# EAGLE design MBC1_1-3 (EAGLE 9.6.2)
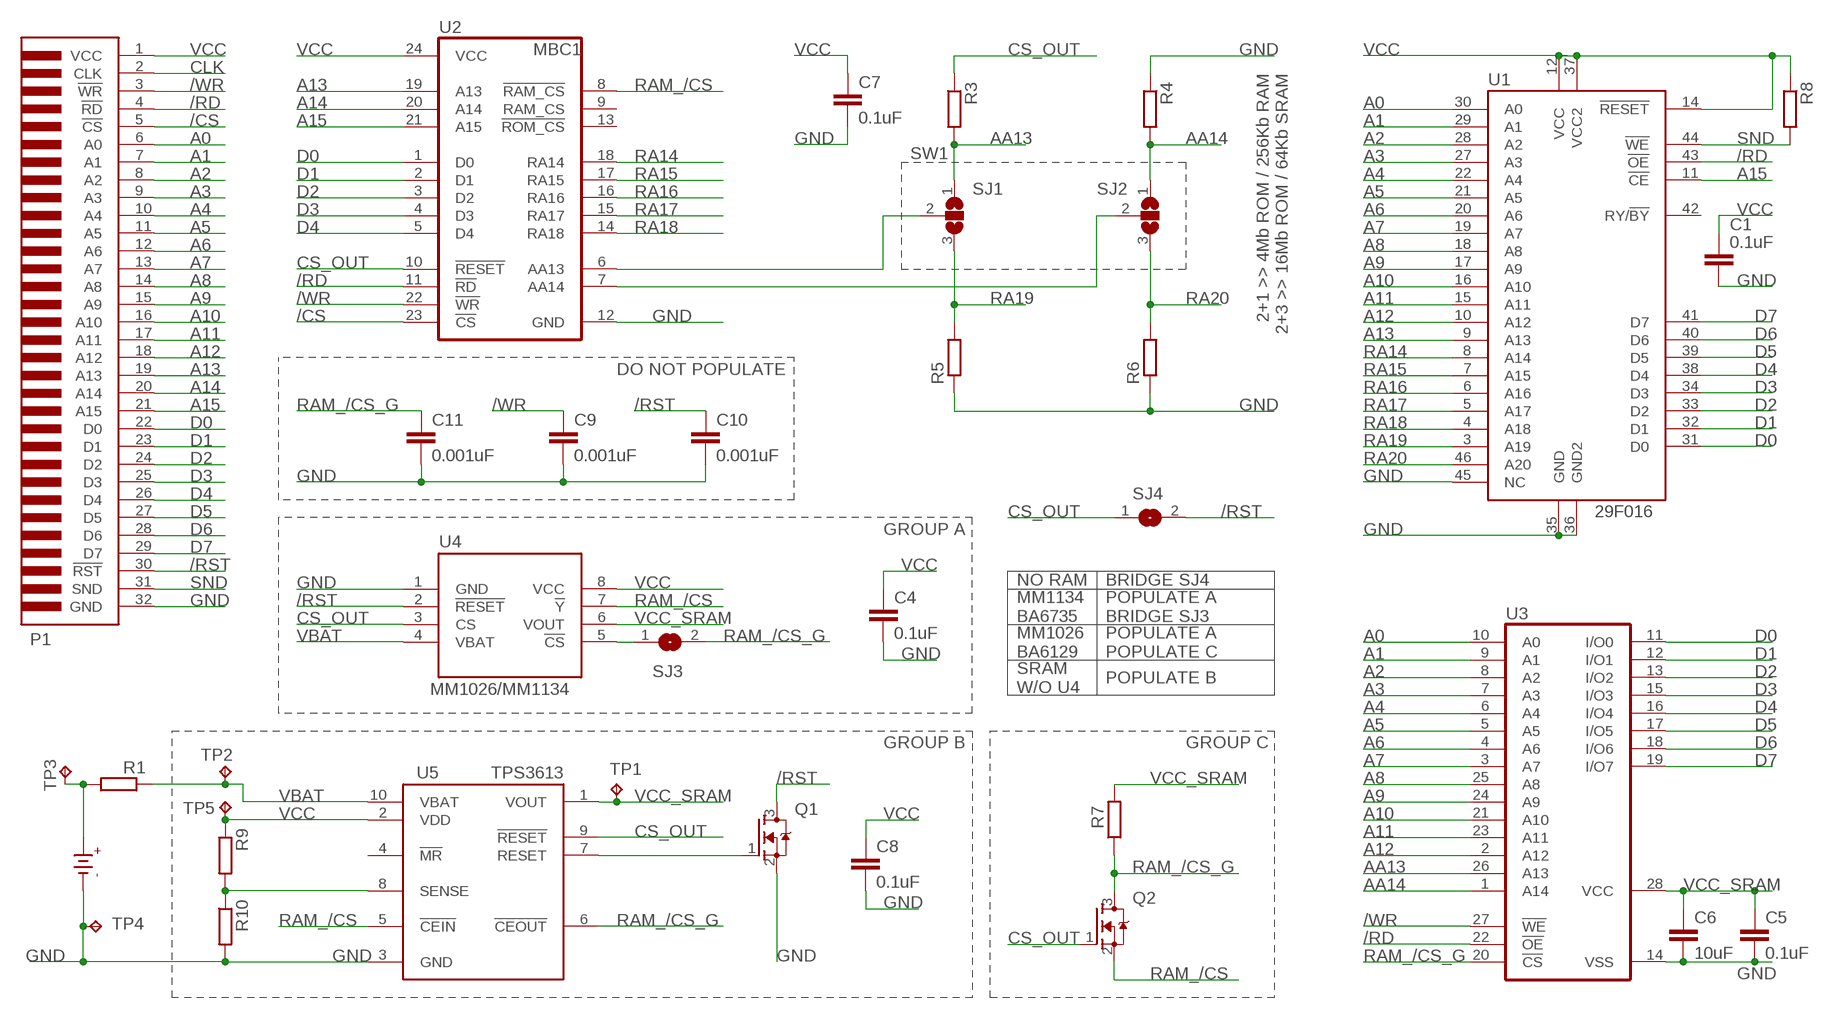
[diagram p0: schematic, sheet 1]

## Parts
B1  CR2025  [CR2025]
C1  0.1uF  C-EUC0603  [C0603]
C4  0.1uF  C-EUC0603  [C0603]
C5  0.1uF  C-EUC0603  [C0603]
C6  10uF  C-EUC0603  [C0603]
C7  0.1uF  C-EUC0603  [C0603]
C8  0.1uF  C-EUC0603  [C0603]
C9  0.001uF  C-EUC0603  [C0603]
C10  0.001uF  C-EUC0603  [C0603]
C11  0.001uF  C-EUC0603  [C0603]
P1  GBC_CART  [GBC_CART]
Q1  2N7002  MOSFET-NREFLOW  [SOT23]
Q2  2N7002  MOSFET-NREFLOW  [SOT23]
R1  RR0603  [R0603]
R3  RR0603  [R0603]
R4  RR0603  [R0603]
R5  RR0603  [R0603]
R6  RR0603  [R0603]
R7  RR0603  [R0603]
R8  RR0603  [R0603]
R9  RR0603  [R0603]
R10  RR0603  [R0603]
SJ1  SJ2W  [SJ_2]
SJ2  SJ2W  [SJ_2]
SJ3  SJ  [SJ]
SJ4  SJ  [SJ]
TP1  TPB1,27  [B1,27]
TP2  TPB1,27  [B1,27]
TP3  TPB1,27  [B1,27]
TP4  TPB1,27  [B1,27]
TP5  TPB1,27  [B1,27]
U1  29F016  [TSOP-48]
U2  MBC1  [SOP-24]
U3  62256_SRAM  [SOP-28L]
U4  MM1134  [SOIC-8]
U5  TPS3613  [MSOP-10]

## Nets
/CS: P1.5(!CS) U2.23(!CS)
/RD: P1.4(!RD) U1.43(!OE) U2.11(!RD) U3.22(!OE)
/RST: C10.1 P1.30(!RST) Q1.3(D) SJ4.2 U4.2(!RESET)
/WR: C9.1 P1.3(!WR) U2.22(!WR) U3.27(!WE)
A0: P1.6(A0) U1.30(A0) U3.10(A0)
A1: P1.7(A1) U1.29(A1) U3.9(A1)
A2: P1.8(A2) U1.28(A2) U3.8(A2)
A3: P1.9(A3) U1.27(A3) U3.7(A3)
A4: P1.10(A4) U1.22(A4) U3.6(A4)
A5: P1.11(A5) U1.21(A5) U3.5(A5)
A6: P1.12(A6) U1.20(A6) U3.4(A6)
A7: P1.13(A7) U1.19(A7) U3.3(A7)
A8: P1.14(A8) U1.18(A8) U3.25(A8)
A9: P1.15(A9) U1.17(A9) U3.24(A9)
A10: P1.16(A10) U1.16(A10) U3.21(A10)
A11: P1.17(A11) U1.15(A11) U3.23(A11)
A12: P1.18(A12) U1.10(A12) U3.2(A12)
A13: P1.19(A13) U1.9(A13) U2.19(A13)
A14: P1.20(A14) U2.20(A14)
A15: P1.21(A15) U1.11(!CE) U2.21(A15)
AA13: R3.2 SJ1.1 U3.26(A13)
AA14: R4.2 SJ2.1 U3.1(A14)
CLK: P1.2(CLK)
CS_OUT: Q2.1(G) R3.1 SJ4.1 U2.10(!RESET) U4.3(CS) U5.9(!RESET)
D0: P1.22(D0) U1.31(D0) U2.1(D0) U3.11(I/O0)
D1: P1.23(D1) U1.32(D1) U2.2(D1) U3.12(I/O1)
D2: P1.24(D2) U1.33(D2) U2.3(D2) U3.13(I/O2)
D3: P1.25(D3) U1.34(D3) U2.4(D3) U3.15(I/O3)
D4: P1.26(D4) U1.38(D4) U2.5(D4) U3.16(I/O4)
D5: P1.27(D5) U1.39(D5) U3.17(I/O5)
D6: P1.28(D6) U1.40(D6) U3.18(I/O6)
D7: P1.29(D7) U1.41(D7) U3.19(I/O7)
GND [GND]: B1.- C1.2 C4.2 C5.2 C6.2 C7.2 C8.2 C9.2 C10.2 C11.2 P1.32(GND) Q1.2(S) R4.1 R5.1 R6.1 R10.2 TP4.TP U1.35(GND) U1.36(GND2) U1.45(NC) U2.12(GND) U3.14(VSS) U4.1(GND) U5.3(GND)
N$1: SJ2.2 U2.7(AA14)
N$2: SJ1.2 U2.6(AA13)
N$3 [VCC]: B1.+ R1.2 TP3.TP
N$4: SJ3.1 U4.5(!CS)
N$6: Q1.1(G) U5.7(RESET)
N$7: R9.2 R10.1 U5.8(SENSE)
RA14: U1.8(A14) U2.18(RA14)
RA15: U1.7(A15) U2.17(RA15)
RA16: U1.6(A16) U2.16(RA16)
RA17: U1.5(A17) U2.15(RA17)
RA18: U1.4(A18) U2.14(RA18)
RA19: R5.2 SJ1.3 U1.3(A19)
RA20: R6.2 SJ2.3 U1.46(A20)
RAM_/CS: Q2.2(S) U2.8(!RAM_CS) U4.7(!Y) U5.5(!CEIN)
RAM_/CS_G: C11.1 Q2.3(D) R7.1 SJ3.2 U3.20(!CS) U5.6(!CEOUT)
SND: P1.31(SND) R8.2 U1.44(!WE)
VBAT [VCC]: R1.1 TP2.TP U4.4(VBAT) U5.10(VBAT)
VCC [VCC]: C1.1 C4.1 C7.1 C8.1 P1.1(VCC) R8.1 R9.1 TP5.TP U1.12(VCC) U1.14(!RESET) U1.37(VCC2) U2.24(VCC) U4.8(VCC) U5.2(VDD)
VCC_SRAM [VCC]: C5.1 C6.1 R7.2 TP1.TP U3.28(VCC) U4.6(VOUT) U5.1(VOUT)
Unconnected: U1.42(RY/!BY) U2.9(RAM_CS) U2.13(!ROM_CS) U5.4(!MR)

## Notes on the sheet
- 2+1 >> 4Mb ROM / 256Kb RAM
  2+3 >> 16Mb ROM / 64Kb SRAM
- SW1
- DO NOT POPULATE
- GROUP A
- NO RAM | BRIDGE SJ4
- MM1134
  BA6735
- POPULATE A
  BRIDGE SJ3
- MM1026
  BA6129
- POPULATE A
  POPULATE C
- SRAM
  W/O U4
- POPULATE B
- MM1026/MM1134
- GROUP B | GROUP C

## Library data of the parts
B1 = gameboylib:CR2025
C1 C4-C11 = rcl:C-EU: CAPACITOR, European symbol; SPICEPREFIX: C
P1 = gameboylib:GBC_CART
Q1 Q2 = adafruit:MOSFET-N: N-Channel Mosfet 2N7002E - 60V 260mA SOT23 [Digikey: 2N7002ET1GOSTR-ND] - REEL BSH103 - 30V 850mA SOT23 [Digikey: 568-5013-1-ND]
R1 R3-R10 = eagle-ltspice:R: RESISTOR, European symbol; SPICEMODEL: NONE; SPICEPREFIX: R
SJ1 SJ2 = jumper:SJ2W: SMD solder JUMPER
SJ3 SJ4 = jumper:SJ: SMD solder JUMPER
TP1-TP5 = testpad:TP: Test pad
U1 = gameboylib:29F016
U2 = gameboy:MBC1: MBC1; OC_FARNELL: unknown; OC_NEWARK: unknown
U3 = gameboylib:62256_SRAM: MEMORY; MPN: CY62256VNLL-70SNXI; OC_FARNELL: 1650073; OC_NEWARK: 19M2582
U4 = gameboylib:MM1134
U5 = gameboylib:TPS3613

## Net classes
1 VCC: width 0.203 mm
2 GND: width 0.203 mm

## Board
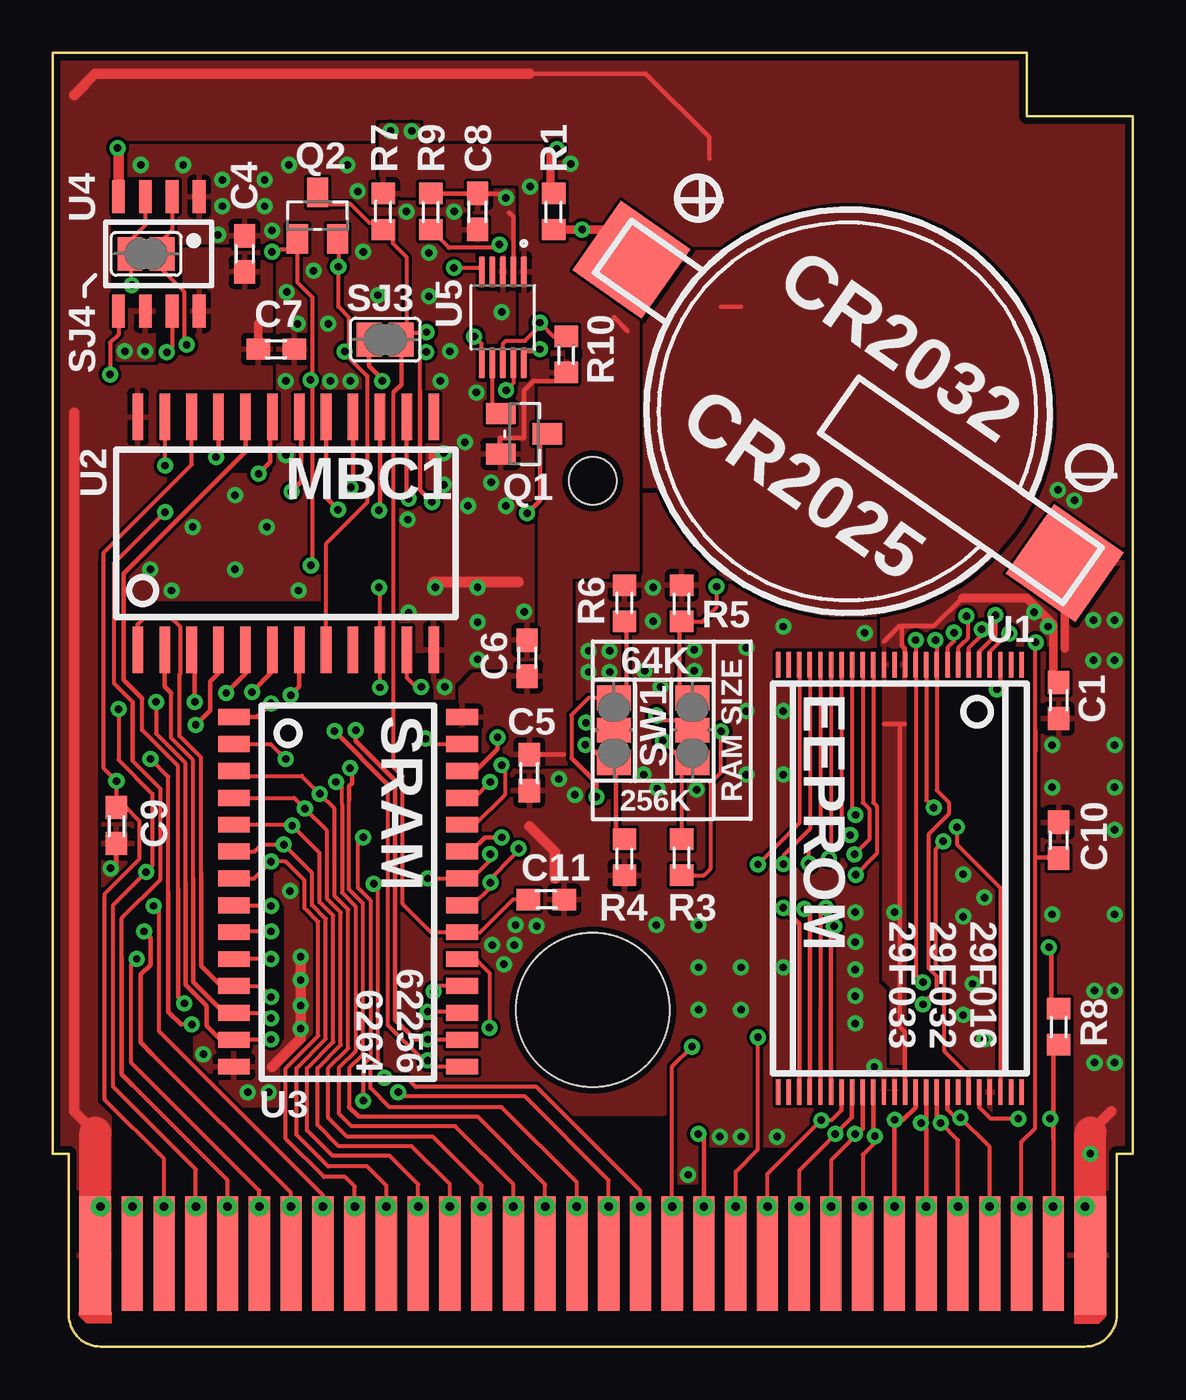
[diagram p1: board, top side]
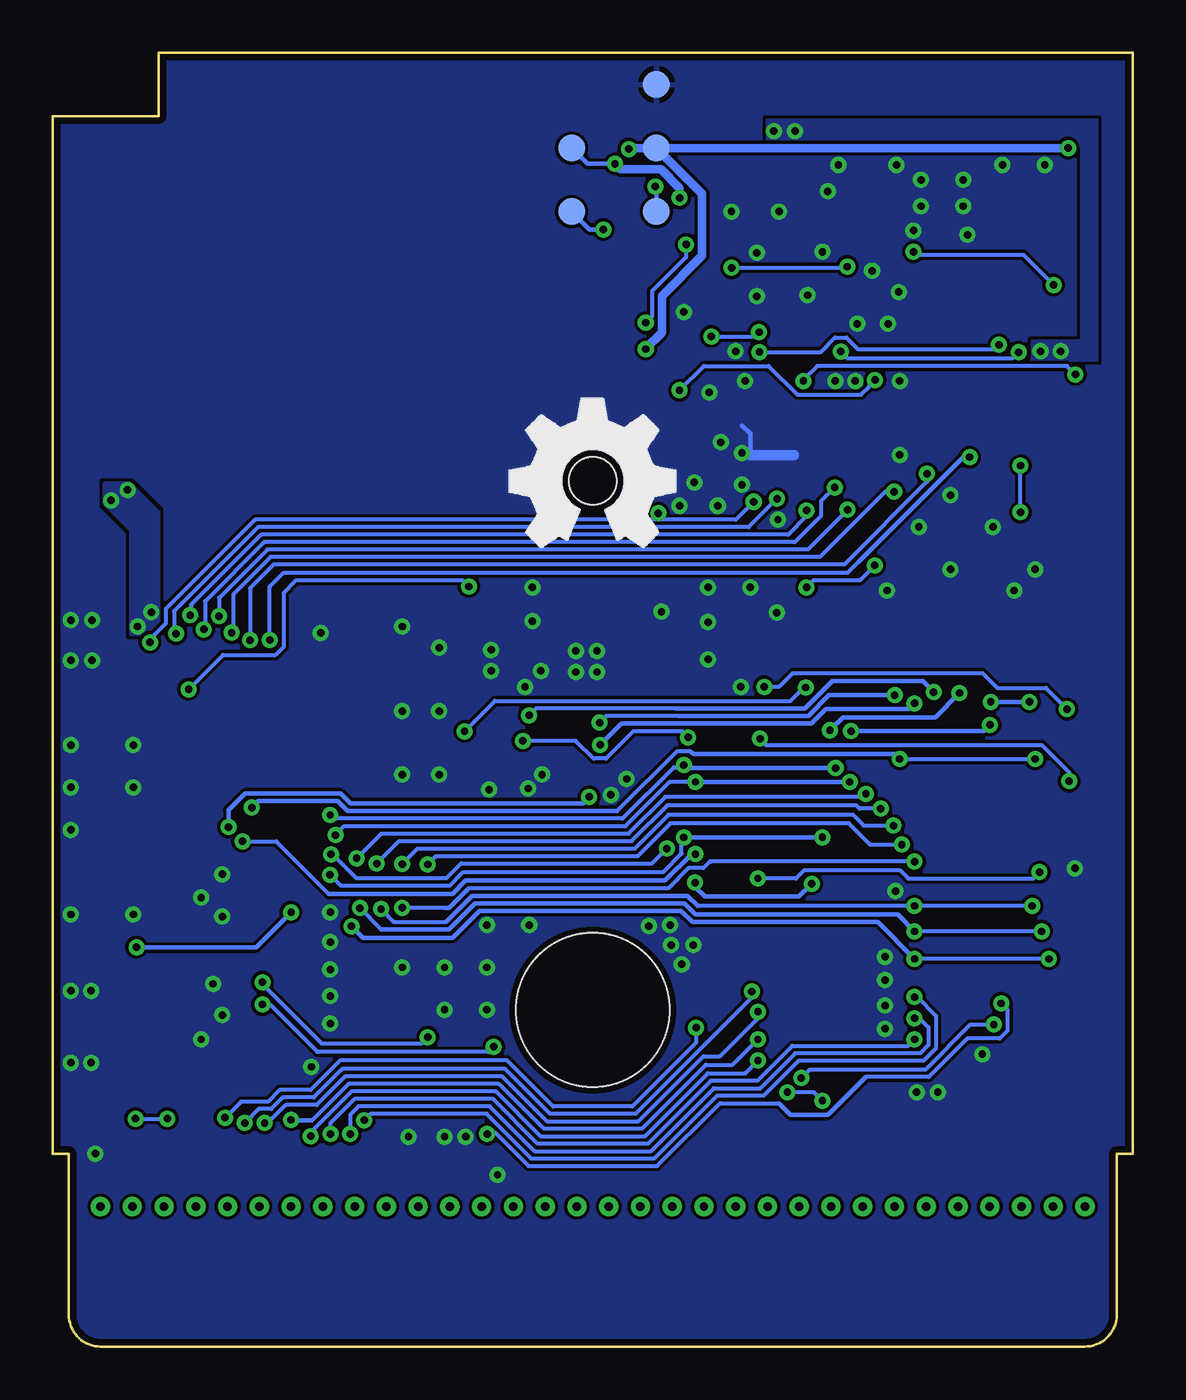
[diagram p2: board, bottom side, seen from below]

Size 51 x 61.1 mm. Coordinates in mm from the lower left corner, seen from the top.
Copper layers (1*16): Top 0.035mm / dielectric 1.5mm / Bottom 0.035mm
Design rules "default *": minimum track width 7mil, minimum drill 13mil, track to track 6mil, track to pad 7mil, pad to pad 7mil, via to via 7mil, smd to smd 5mil, copper to edge 12mil, drill to drill 22mil, minimum pad ring 10mil, minimum via ring 8mil, stop-mask expansion 4mil, vias tented up to drill 14mil, thermal gap 10mil
tKeepout: area -1.8,-1.5 to 54,11.6; area -1,11.1 to 2,62.1; area 49,11.1 to 52,62.1; area 2,55.1 to 49,62.1
tRestrict: area 3.6,34.7 to 13.7,35.1; area 30.8,8.8 to 34.9,9.3; area 46.6,15.7 to 48,16.3; area 47.9,14.4 to 48.1,15.8; area 47.4,5.6 to 48.1,14; area 10.2,14.5 to 10.8,20.8; area 9.6,21.1 to 10.3,22.5; area 17.8,29.4 to 18.9,30.5; area 34.1,12.2 to 39,12.7; area 34.2,32.4 to 38.8,32.9; area 38.8,11.3 to 40.2,12; area 46.6,0.8 to 49.9,1.3; area 19.3,20 to 20.1,29.2; area 5,44.8 to 10.3,45.1; area 8,41.4 to 10.2,41.9; area 26.6,6.8 to 34.7,7.6; area 12.7,44.5 to 14.4,45.1; area 16.5,29.8 to 17.9,31.1; area 8.8,10.4 to 10.9,11.2; area 5.7,13.6 to 6.5,14.7; area 17.1,31.9 to 17.6,32.7; area 3.5,54.6 to 5.3,55.2; area 27.8,40.4 to 28.4,40.5; area 24.3,10.3 to 28.9,10.8; area 24.3,46.7 to 24.9,47.1; area 23,53.4 to 24.3,53.9
bRestrict: area 25,39.4 to 26,39.6

### Footprints (pad centres in the part's own frame; a part is rotated, then mirrored left to right if it is on the bottom)
CR2025 = smd 4 x 4: + -12,0; - 13,0
C0603 = smd 1.1 x 1: 1 -0.85,0; 2 0.85,0
GBC_CART = smd 1.5 x 5.6: 1 -23.4,-25.01; 32 23.6,-25.01 | smd 1 x 5.4: 2 -21.65,-24.91; 3 -20.15,-24.91; 4 -18.65,-24.91; 5 -17.15,-24.91; 6 -15.65,-24.91; 7 -14.15,-24.91; 8 -12.65,-24.91; 9 -11.15,-24.91; 10 -9.65,-24.91; 11 -8.15,-24.91; 12 -6.65,-24.91; 13 -5.15,-24.91; 14 -3.65,-24.91; 15 -2.15,-24.91; 16 -0.65,-24.91; 17 0.85,-24.91; 18 2.35,-24.91; 19 3.85,-24.91; 20 5.35,-24.91; 21 6.85,-24.91; 22 8.35,-24.91; 23 9.85,-24.91; 24 11.35,-24.91; 25 12.85,-24.91; 26 14.35,-24.91; 27 15.85,-24.91; 28 17.35,-24.91; 29 18.85,-24.91; 30 20.35,-24.91; 31 21.85,-24.91 | drill 0.4: P$1 -21.65,-22.7; P$2 -18.65,-22.7; P$3 -15.65,-22.7; P$4 -12.65,-22.7; P$5 -9.65,-22.7; P$6 -6.65,-22.7; P$7 -3.65,-22.7; P$8 -0.65,-22.7; P$9 2.35,-22.7; P$10 5.35,-22.7; P$11 8.35,-22.7; P$12 11.35,-22.7; P$13 14.35,-22.7; P$14 17.35,-22.7; P$15 20.35,-22.7; P$16 23.35,-22.7; P$17 21.85,-22.7; P$18 18.85,-22.7; P$19 15.85,-22.7; P$20 12.85,-22.7; P$21 9.85,-22.7; P$22 6.85,-22.7; P$23 3.85,-22.7; P$24 0.85,-22.7; P$25 -2.15,-22.7; P$26 -5.15,-22.7; P$27 -8.15,-22.7; P$28 -11.15,-22.7; P$29 -14.15,-22.7; P$30 -17.15,-22.7; P$31 -20.15,-22.7; P$32 -23.15,-22.7 | hole 7.25: 0.1,-13.41 | hole 2.25: 0.1,11.585
SOT23 = smd 1 x 1.4: 1 -0.95,-1.1; 2 0.95,-1.1; 3 0,1.1
R0603 = smd 1 x 1.1: 1 -0.85,0; 2 0.85,0
SJ_2 = smd 1.168 x 1.6: 1 -1.524,0; 2 0,0; 3 1.524,0
SJ = smd 1.168 x 1.6: 1 -0.762,0; 2 0.762,0
B1,27 = smd 1.27 x 1.27: TP 0,0
TSOP-48 = smd 1.2 x 0.21: 1 -10.1,5.75; 2 -10.1,5.25; 3 -10.1,4.75; 4 -10.1,4.25; 5 -10.1,3.75; 6 -10.1,3.25; 7 -10.1,2.75; 8 -10.1,2.25; 9 -10.1,1.75; 10 -10.1,1.25; 11 -10.1,0.75; 12 -10.1,0.25; 13 -10.1,-0.25; 14 -10.1,-0.75; 15 -10.1,-1.25; 16 -10.1,-1.75; 17 -10.1,-2.25; 18 -10.1,-2.75; 19 -10.1,-3.25; 20 -10.1,-3.75; 21 -10.1,-4.25; 22 -10.1,-4.75; 23 -10.1,-5.25; 24 -10.1,-5.75; 25 10.1,-5.75; 26 10.1,-5.25; 27 10.1,-4.75; 28 10.1,-4.25; 29 10.1,-3.75; 30 10.1,-3.25; 31 10.1,-2.75; 32 10.1,-2.25; 33 10.1,-1.75; 34 10.1,-1.25; 35 10.1,-0.75; 36 10.1,-0.25; 37 10.1,0.25; 38 10.1,0.75; 39 10.1,1.25; 40 10.1,1.75; 41 10.1,2.25; 42 10.1,2.75; 43 10.1,3.25; 44 10.1,3.75; 45 10.1,4.25; 46 10.1,4.75; 47 10.1,5.25; 48 10.1,5.75
SOP-24 = smd 0.5 x 2.2: 1 -6.985,-5.5; 2 -5.715,-5.5; 3 -4.445,-5.5; 4 -3.175,-5.5; 5 -1.905,-5.5; 6 -0.635,-5.5; 7 0.635,-5.5; 8 1.905,-5.5; 9 3.175,-5.5; 10 4.445,-5.5; 11 5.715,-5.5; 12 6.985,-5.5; 13 6.985,5.5; 14 5.715,5.5; 15 4.445,5.5; 16 3.175,5.5; 17 1.905,5.5; 18 0.635,5.5; 19 -0.635,5.5; 20 -1.905,5.5; 21 -3.175,5.5; 22 -4.445,5.5; 23 -5.715,5.5; 24 -6.985,5.5
SOP-28L = smd 0.75 x 1.5: 1 -7.62,-5.457; 2 -6.35,-5.457; 3 -5.08,-5.457; 4 -3.81,-5.457; 5 -2.54,-5.457; 6 -1.27,-5.457; 7 0,-5.457; 8 1.27,-5.457; 9 2.54,-5.457; 10 3.81,-5.457; 11 5.08,-5.457; 12 6.35,-5.457; 13 7.62,-5.457; 14 8.89,-5.457; 15 8.89,5.33; 16 7.62,5.33; 17 6.35,5.33; 18 5.08,5.33; 19 3.81,5.33; 20 2.54,5.33; 21 1.27,5.33; 22 0,5.33; 23 -1.27,5.33; 24 -2.54,5.33; 25 -3.81,5.33; 26 -5.08,5.33; 27 -6.35,5.33; 28 -7.62,5.33
SOIC-8 = smd 0.6 x 1.55: 1 1.905,2.7; 2 0.635,2.7; 3 -0.635,2.7; 4 -1.905,2.7; 5 -1.905,-2.7; 6 -0.635,-2.7; 7 0.635,-2.7; 8 1.905,-2.7
MSOP-10 = smd 1.47 x 0.28: 1 -2.15,1; 2 -2.15,0.5; 3 -2.15,0; 4 -2.15,-0.5; 5 -2.15,-1; 6 2.15,-1; 7 2.15,-0.5; 8 2.15,0; 9 2.15,0.5; 10 2.15,1

### Placement (x,y rotation side)
B1  37.15,44.46 325 top
C1  47.5,30.51 270 top
C4  9.05,51.61 90 top
C5  22.5,27.11 270 top
C6  22.4,32.51 90 top
C7  10.55,47.11 0 top
C8  20.05,53.61 270 top
C9  3,24.61 270 top
C10  47.5,23.91 90 top
C11  23.3,21.11 0 top
P1  25.4,29.31 0 top
Q1  22.25,43.11 270 top
Q2  12.5,53.41 0 top
R1  23.65,53.61 270 top
R3  29.7,23.11 90 top
R4  27,23.11 90 top
R5  29.7,35.11 270 top
R6  27,35.11 270 top
R7  15.6,53.61 90 top
R8  47.5,15.11 270 top
R9  17.85,53.61 270 top
R10  24.25,46.86 270 top
SJ1  30.2,29.11 90 top
SJ2  26.5,29.11 90 top
SJ3  15.7,47.56 0 top
SJ4  4.4,51.61 0 top
TP1  22.5,53.61 0 bottom
TP2  22.5,56.61 0 bottom
TP3  26.5,53.61 0 bottom
TP4  22.5,59.61 0 bottom
TP5  26.5,56.61 0 bottom
U1  40,22.11 270 top
U2  11,38.41 0 top
U3  14,22.11 270 top
U4  5,51.61 0 top
U5  21.25,48.61 270 top

### Tracks (layer width: path | path; a pad name or v marks a point on that pad's centre or on a via)
/CS  (via drill 0.35)
  Top 0.2: P1.5 8.25,7.86 3.8,12.31 | v5.3,39.41 2.89,37 2.89,31.32 3.76,30.45 | v5.3,41.61 5.3,43.89 U2.23 | 3.25,18.11 3.25,20.24 5.08,22.07 5.08,26.34 3.76,27.67
  Top 0.203: 3.8,12.31 3.25,12.86 3.25,18.11 3.25,18.33 | 3.76,27.67 3.76,30.45
  Bottom 0.2: v5.3,39.41 v5.3,41.61
/RD  (via drill 0.35)
  Top 0.2: P1.4 6.75,8.36 2.85,12.26 2.85,20.86 v4.4,22.41 4.7,22.71 4.7,26.11 3.1,27.71 v3.1,30.11 | v17.7,22.11 U3.22 19.8,22.11 20.65,22.96 v20.65,23.26 | U2.11 16.71,31.59 17.15,31.16 v17.4,31.16 | v42.05,23.86 41.7,23.52 41.7,18.03 42.11,17.63 42.11,13.95 43.25,12.81
  Top 0.203: U1.43 43.25,12.81
  Bottom 0.2: v17.7,22.11 15.9,22.11 15.5,22.51 11,22.51 10.6,22.11 4.7,22.11 v4.4,22.41 | v3.1,30.11 4.1,31.11 6.4,31.11 7.1,31.81 16.05,31.81 16.7,31.16 v17.4,31.16 | v42.05,23.86 40.45,23.86 37.97,21.38
  Bottom 0.203: v20.65,23.26 20.83,23.26 22.08,22 31.51,22 32.13,21.38 34.23,21.38 34.77,21.38 37.97,21.38
/RST  (via drill 0.35)
  Top 0.2: 46.39,28.11 46.39,10.31 45.75,9.67 P1.30 | 46.39,23.11 46.39,29.11 46.39,33.24 v46.42,33.26 | U4.2 5.63,52.74 5.08,52.19 5.08,51.53 5.08,50.93 6.21,49.8 6.21,47.42 v6.32,47.32 | 17.34,45.1 17.34,46.69 v17.63,46.98
  Top 0.203: 46.39,28.11 46.39,29.11 | C10.1 47.5,23.11 46.39,23.11 | SJ4.2 5.08,51.53 5.07,51.51 | U4.2 5.6,54.31 | v17.9,39.9 17.34,40.45 17.34,45.1 | Q1.3 23.15,43.11 23,42.96 23,39.96 v22.4,39.36
  Bottom 0.2: v17.63,46.98 14.73,46.98 14.06,47.65 13.52,47.65 12.97,47.11 6.53,47.11 v6.32,47.32 | v17.9,39.9 18.75,39.05 22.4,39.05 | 22.4,39.05 41.46,39.05 45.67,34.84 45.67,34.16 46.42,33.41 v46.42,33.26 | v22.4,39.36 22.4,39.05
  Bottom 0.203: 22.4,39.06 v22.4,39.36
/WR  (via drill 0.35)
  Top 0.2: P1.3 5.25,8.86 2.45,11.66 2.45,21.38 4.1,23.04 4.1,24.81 3.45,25.46 C9.1 v3,26.71 2.4,27.31 2.4,37.51 6.55,41.66 U2.22 | v17.6,28.71 17.85,28.46 U3.27
  Bottom 0.2: v17.6,28.71 17.3,28.41 4.3,28.41 3,27.11 v3,26.71
A0  (via drill 0.35)
  Top 0.2: P1.6 9.75,7.36 3.7,13.41 3.7,18.05 v3.96,18.31 | v10.3,18.31 8.8,18.31 U3.10 | 36.75,19.7 v36.9,19.85
  Top 0.203: U1.30 36.75,19.7
  Bottom 0.2: v3.96,18.31 v10.3,18.31
  Bottom 0.203: v10.3,18.31 12.04,20.05 20.8,20.05 21.33,20.58 30.86,20.58 32.13,19.31 36.36,19.31 v36.9,19.85
A1  (via drill 0.35)
  Top 0.2: P1.7 11.25,7.26 4.7,13.81 | v10.3,19.61 8.83,19.61 U3.9 | v36.5,20.71 36.24,20.45 36.24,15.98
  Top 0.203: 4.7,13.81 4.15,14.36 4.15,17.58 4.61,18.04 4.61,19.3 v4.3,19.61 | U1.29 36.25,15.98 36.24,15.98
  Bottom 0.2: v4.3,19.61 v10.3,19.61 | 35.5,19.71 v36.5,20.71
  Bottom 0.203: v10.3,19.61 11.1,20.41 20.65,20.41 21.18,20.94 31.07,20.94 32.3,19.71 35.5,19.71
A2  (via drill 0.35)
  Top 0.2: P1.8 12.75,7.16 5,14.91 5,20.56 v4.75,20.81 | v10.3,20.81 8.82,20.81 U3.8 | 35.75,20.48 35.56,20.67 v35.5,20.67
  Top 0.203: U1.28 35.75,20.48
  Bottom 0.2: v4.75,20.81 v10.3,20.81 20.53,20.81 | v35.5,20.67 34.9,20.07 32.44,20.07
  Bottom 0.203: 32.44,20.07 31.21,21.29 21.02,21.29 20.53,20.81
A3  (via drill 0.35)
  Top 0.2: P1.9 14.25,7.56 13.8,8.01 12.8,8.01 11,9.81 11,13.15 12.53,14.68 12.53,20.06 11.89,20.71 11.89,22.02 11,22.91 v10.3,22.91 9.5,22.11 U3.7 | v34.5,20.72 35.06,20.17
  Top 0.203: U1.27 35.25,19.97 35.06,20.17
  Bottom 0.2: v10.3,22.91 19.9,22.91 | 32.54,20.72 v34.5,20.72 | 19.97,22.91 20.28,22.6 20.98,22.6 21.94,21.65 31.36,21.65
  Bottom 0.203: 19.9,22.91 19.97,22.91 | 31.36,21.65 32.29,20.72 32.54,20.72
A4  (via drill 0.35)
  Top 0.2: P1.10 15.75,7.6 14.84,8.51 13,8.51 11.5,10.01 11.5,13.15 12.89,14.53 12.89,20.21 12.24,20.85 12.24,22.37 v10.9,23.71 9.85,23.71 9.52,23.38 U3.6 | v33.3,22.77 35.25,24.72 U1.22
  Bottom 0.2: v10.9,23.71 12.4,23.71 13.4,24.71 21.83,24.71 23.37,23.17 32.9,23.17 v33.3,22.77
A5  (via drill 0.35)
  Top 0.2: P1.11 17.25,7.66 15.9,9.01 13.2,9.01 12,10.21 12,13.15 13.24,14.39 13.24,20.35 12.59,21 12.59,23.32 v11.3,24.61 11.26,24.65 U3.5 | v34.51,22.79 34.51,23.19 35.72,24.39 35.75,24.43 U1.21
  Bottom 0.2: v11.3,24.61 12.7,24.61 13.2,25.11 21.93,25.11 23.52,23.52 33.77,23.52 v34.51,22.79
A6  (via drill 0.35)
  Top 0.2: P1.12 18.75,7.66 16.95,9.46 13.5,9.46 12.5,10.46 12.5,13.15 13.59,14.24 13.59,20.5 12.94,21.15 12.94,24.37 v11.9,25.41 11.39,25.92 U3.4 | v35.71,22.81 35.71,23.56 36.13,23.98 36.25,24.1 U1.20
  Bottom 0.2: v11.9,25.41 12.9,25.41 13.06,25.57 21.97,25.57 23.66,23.88 34.64,23.88 v35.71,22.81
A7  (via drill 0.35)
  Top 0.2: P1.13 20.25,7.61 17.95,9.91 13.9,9.91 13,10.81 13,13.15 13.94,14.09 13.94,20.64 13.29,21.29 13.29,25.41 v12.6,26.11 11.75,26.96 8.77,26.96 U3.3 | v36.66,23.06 36.75,23.15 U1.19
  Bottom 0.2: v12.6,26.11 12.74,25.97 22.07,25.97 23.81,24.23 35.49,24.23 v36.66,23.06
A8  (via drill 0.35)
  Top 0.2: P1.14 21.75,7.66 19,10.41 14.1,10.41 13.5,11.01 13.5,13.15 14.29,13.95 14.29,20.79 13.65,21.44 13.65,25.66 13.65,26.38 v13.37,26.67 | U3.25 19.9,25.92 v20.65,26.67 | v37.66,24.16 37.25,24.57 U1.18
  Bottom 0.2: 20,26.67 21.87,26.67 23.95,24.58 37.23,24.58 v37.66,24.16
  Bottom 0.203: v13.37,26.67 20,26.67 v20.65,26.67
A9  (via drill 0.35)
  Top 0.2: P1.15 23.25,7.66 20.05,10.86 14.45,10.86 | U3.24 19.94,24.65 21.35,26.06 21.35,27.31 v21.2,27.46 | v37.91,25.11 37.75,25.27 U1.17 | 14,11.34 14,13.16 14.65,13.8 14.65,20.94 14,21.58 14,26.11
  Top 0.203: 14,25.81 14,26.11 14,26.47 14.12,26.59 14.12,27.23 v14.03,27.32 | 14,11.34 14,11.31 14.45,10.86
  Bottom 0.2: v21.2,27.46 21.3,27.36 21.67,27.36 24.1,24.93 37.73,24.93 v37.91,25.11
  Bottom 0.203: v14.03,27.32 21.06,27.32 v21.2,27.46
A10  (via drill 0.35)
  Top 0.2: P1.16 24.75,7.76 21.2,11.31 15.9,11.31 15,12.21 15,13.16 15.36,13.52 15.36,21.65 v15.16,21.85 | U3.21 19.09,20.85 19.82,20.85 20.66,21.7 | v22,23.52 22,23.23 21.8,23.23 20.62,22.05 | v37.86,23.25 38.56,23.95 38.56,25.38 38.25,25.69 U1.16
  Top 0.203: 20.62,22.05 v20.66,21.92 20.66,21.7
  Bottom 0.2: v22,23.52 22.7,22.82 31.72,22.82 32.42,22.11 36.66,22.11 37.79,23.25 v37.86,23.25
  Bottom 0.203: v15.16,21.85 15.76,21.25 20.2,21.25 20.66,21.72 v20.66,21.92
A11  (via drill 0.35)
  Top 0.2: P1.17 26.25,7.86 22.3,11.81 16.51,11.81 v16.31,12.02 | U3.23 19.74,23.38 20.38,24.02 | v37.92,22.28 38.91,23.28 38.91,25.53 38.75,25.69 U1.15 | v14.66,24.05 14.66,24.03 14.4,23.78 14.4,21.68 15,21.08 15,13.66 14.65,13.3 14.65,12.06 14.66,12.06 v14.66,11.61
  Top 0.203: v21.2,24.04 20.4,24.04 19.74,23.38 U3.23
  Bottom 0.2: v14.66,11.61 15.06,12.02 v16.31,12.02 | v37.92,22.28 37.4,21.76 32.27,21.76 31.62,22.42 22.17,22.42 21.31,23.28 21.31,23.78 21.2,23.89 v21.2,24.04
  Bottom 0.203: v14.66,24.05 v14.66,24.06 21.19,24.06 v21.2,24.04
A12  (via drill 0.35)
  Top 0.2: P1.18 27.75,7.36 22.85,12.26 17.13,12.26 16.7,12.69 v15.66,12.69 | v6.56,15.21 6.06,15.21 | U3.2 10.29,28.46 v11,27.75 | v41.61,25.46 41.25,25.82 U1.10 | v4.61,27.75 5.45,26.91 5.45,21.11
  Top 0.203: 6.06,15.21 5.45,15.81 5.45,21.11 5.45,21.49
  Bottom 0.2: v15.66,12.69 15.26,13.09 9.78,13.09 7.66,15.21 v6.56,15.21 | 11.23,27.98 v11,27.75 v4.61,27.75 | 24.35,25.29 21.52,28.12 20.88,28.12
  Bottom 0.203: 20.88,28.12 20.74,27.98 11.23,27.98 | v41.61,25.46 41.3,25.77 37.56,25.77 37.08,25.29 24.35,25.29
A13  (via drill 0.35)
  Top 0.2: P1.19 29.25,13.23 v30.18,14.17 | v41.1,16.16 41.1,16.2 41.76,16.85 41.76,17.48 41.35,17.88 41.35,24.18 42.31,25.14 42.31,25.7 41.75,26.27 U1.9 41.75,33.3
  Top 0.203: v9.71,41.23 10.27,41.77 10.27,43.31 10.37,43.41 U2.19 | v41.69,33.36 41.75,33.3
  Bottom 0.2: v30.18,14.17 30.44,13.91 38.5,13.91 40.75,16.16 v41.1,16.16 | 9.71,40.84 13.62,36.94 40.57,36.94 41.69,35.82 v41.69,33.36
  Bottom 0.203: 9.71,40.84 v9.71,41.23
A14  (via drill 0.35)
  Top 0.2: 5.91,16.51 v6.21,16.21 | 4.21,30.61 4.21,29.11 5.91,27.42 5.91,21.11
  Top 0.203: P1.20 30.75,10.04 v30.48,10.04 | 5.91,21.64 5.91,21.11 5.91,16.51 | 4.21,30.61 3.34,31.48 3.34,36.52 9.1,42.27 U2.20
  Bottom 0.2: 12.6,12.73 9.63,12.73 7.81,14.55 6.28,14.55 5.9,14.94 5.9,15.9 v6.21,16.21 | v30.48,10.04 30.41,10.11 30.13,10.11 28.54,8.53 22.46,8.53 19.49,11.49 16.71,11.49
  Bottom 0.203: 12.6,12.73 14.38,10.95 16.17,10.95 16.71,11.49
A15  (via drill 0.35)
  Top 0.2: P1.21 32.25,8.26 33.3,9.31 v33.3,14.61 | v41.1,17.21 40.75,17.56 U1.11 v40.76,33.37
  Top 0.203: U2.21 7.83,42.13 v7.7,42.01 | v40.75,33.36 v40.76,33.37
  Bottom 0.2: v41.1,17.21 41.1,17.11 38.3,14.31 33.6,14.31 v33.3,14.61 | v40.76,33.37 v40.75,33.38 40.75,35.9 40.1,36.55 13.45,36.55 12.95,37.06
  Bottom 0.203: 12.95,37.05 12.95,37.06 8,42.01 v7.7,42.01
AA13  (via drill 0.35)
  Top 0.2: v28.81,28.61 29.83,27.59 SJ1.1 29.7,27.09 R3.2
  Top 0.203: U3.26 19.97,27.19 21,28.22 v21,28.77
  Bottom 0.2: v21,28.77 21.29,29.07 23.57,29.07 24.87,27.77 25.46,27.77 26.31,28.61 v28.81,28.61
AA14  (via drill 0.35)
  Top 0.2: 25.26,28.42 26.1,27.59 SJ2.1
  Top 0.203: U3.1 9.65,29.73 v10.3,30.38 | SJ2.1 26.6,27.49 26.6,24.36 R4.2 | 25.26,28.42 v25.15,28.42
  Bottom 0.203: v10.3,30.38 10.57,30.11 14.5,30.11 15.18,29.43 24.14,29.43 v25.15,28.42
CS_OUT  (via drill 0.35)
  Top 0.2: U2.10 15.45,34.11 | 15.45,34.11 15.45,35.95 15.4,35.95 v15.4,35.85 | v12.18,36.89 12.27,36.89 12.27,45.61 | 12.27,45.61 12.27,49.54 11.55,50.26 11.55,52.06 | v15.44,31.13 15.44,34.11 15.45,34.11 | R3.1 30.75,22.26 31.06,22.57 31.06,26.61 31.56,27.11 v31.56,29.06 | U4.3 4.37,52.98 3.64,52.25 SJ4.1 | v3.73,50.14 3.71,50.16 3.71,51.54 | v10.35,51.71 10.45,51.81 11.3,51.81 11.55,52.06 | Q2.1 11.55,52.06 | U5.9 21.75,45.51 v21.41,45.17 | v12.17,45.65 12.23,45.65 12.27,45.61
  Top 0.203: 3.64,51.21 SJ4.1 3.71,51.54
  Bottom 0.2: v10.35,51.71 10.2,51.56 5.16,51.56 v3.73,50.14 | v15.44,31.13 15.53,31.13 16.16,30.5 30.12,30.5 v31.56,29.06 | v15.4,35.85 15.07,36.19 12.89,36.19 v12.18,36.89 | v21.41,45.17 20.26,46.32 17.19,46.32 15.83,44.95 12.83,44.95 12.44,45.34 12.44,45.38 v12.17,45.65
D0  (via drill 0.35)
  Top 0.2: U3.11 9.78,17.03 v10.3,16.51 | P1.22 33.75,8.16 v36.28,10.69 v36.29,10.69 36.78,10.69 37.25,11.16 | 5.99,31.75 5.98,31.75 | 5.99,31.75 5.99,28.84 7,27.82 7,22.11 | U2.1 4,32.92 4,34.11 4.4,34.51 5.5,34.51 6,34.01 6,31.76 5.99,31.75
  Top 0.203: U3.11 7.95,17.03 7,17.98 7,22.11 7,22.35 | 4.01,32.8 U2.1 | U1.31 37.25,11.16
  Bottom 0.2: v10.3,16.51 10.17,16.51 9.29,15.63 9.29,14.09 9.88,13.5 15.78,13.5 17.44,11.85 19.63,11.85 22.6,8.88 28.4,8.88 30.51,11 35.99,11 v36.29,10.69
D1  (via drill 0.35)
  Top 0.2: U3.12 10.05,15.76 v10.3,15.51 | P1.23 35.25,8.32 v36.96,10.03 v36.96,10.04 37.75,10.83 | 5.58,30.88 5.58,28.75 6.62,27.7 6.62,22.11
  Top 0.203: U3.12 8.09,15.76 6.62,17.23 6.62,22.11 6.62,22.13 | 5.58,30.88 5.29,31.17 U2.2 | U1.32 37.75,10.83
  Bottom 0.2: v10.3,15.51 10.07,15.51 9.64,15.08 9.64,14.24 10.03,13.85 15.93,13.85 17.58,12.2 19.78,12.2 22.75,9.23 28.25,9.23 30.37,11.35 36.56,11.35 36.95,10.96 36.95,10.04 v36.96,10.04
D2  (via drill 0.35)
  Top 0.2: P1.24 36.75,8.79 38,10.04 | U3.13 10.28,14.49 v10.3,14.51 | 38.25,10.29 38,10.04 | 38,10.04 v37.89,10.04 | v4.87,30.45 4.87,28.96 6.26,27.56 6.26,21.88
  Top 0.203: U3.13 7.92,14.49 7.27,15.14 7.27,16.08 6.26,17.08 6.26,21.88 | v6.7,30.45 6.7,32.91 U2.3 | U1.33 38.25,10.29
  Bottom 0.2: v10.3,14.51 10.6,14.21 16.07,14.21 17.73,12.55 19.93,12.55 22.9,9.58 28.1,9.58 30.22,11.7 36.75,11.7 37.89,10.56 v37.89,10.04
  Bottom 0.203: v4.87,30.45 v6.7,30.45
D3  (via drill 0.35)
  Top 0.2: U3.15 17.99,13.22 v17.7,13.51 | P1.25 38.25,9.06 38.75,9.56 38.75,10.01 v38.83,9.94 | 17.5,13.51 15.81,15.2 15.81,26.55
  Top 0.203: v17.7,13.51 17.5,13.51 | 15.81,26.55 v13.3,29.07 | v6.74,29.36 7.42,30.04 7.42,31.41 7.83,31.81 U2.4 | U1.34 38.75,10.01
  Bottom 0.2: v17.7,13.51 18.3,12.91 20.07,12.91 23.04,9.94 27.96,9.94 30.08,12.05 36.9,12.05 38.83,10.12 v38.83,9.94
  Bottom 0.203: v13.3,29.07 7.04,29.07 v6.74,29.36
D4  (via drill 0.35)
  Top 0.2: U3.16 17.72,14.49 v17.7,14.51
  Top 0.203: v17.7,14.51 17.1,14.51 16.17,15.44 16.17,26.74 14.3,28.61 v14.3,29.11 | v8.18,30.87 9.1,31.78 U2.5 | P1.26 v39.75,10.7 v39.76,10.71 40.15,10.71 40.75,11.31 U1.38
  Bottom 0.2: v17.7,14.51 18.9,13.31 20.17,13.31 23.19,10.29 27.81,10.29 29.93,12.4 37.04,12.4 | 37.04,12.4 | 37.04,12.4 38.77,10.68 39,10.68
  Bottom 0.203: v14.3,29.11 13.69,29.72 9.33,29.72 v8.18,30.87 | v39.76,10.71 39.73,10.68 39,10.68 38.77,10.68
D5  (via drill 0.35)
  Top 0.2: U3.17 19.03,15.81 v17.7,15.81
  Top 0.203: P1.27 41.25,10.31 v41,10.56 41.06,10.56 41.25,10.75 U1.39
  Bottom 0.2: v17.7,15.81 17.7,15.51 19.5,13.71 20.26,13.71 23.33,10.64 27.67,10.64 29.78,12.76 37.19,12.76 38.54,11.41 40,11.41 40.85,10.56 v41,10.56
D6  (via drill 0.35)
  Top 0.2: U3.18 18.25,17.03 v17.99,16.77 | 41.75,10.74 v41.93,10.56 42.75,9.74 P1.28
  Top 0.203: U1.40 41.75,10.74
  Bottom 0.2: v17.99,16.77 17.85,16.63 23.48,10.99 27.52,10.99 29.64,13.11 37.34,13.11 38.69,11.76 40.15,11.76 40.69,11.22 41.27,11.22 v41.93,10.56
D7  (via drill 0.35)
  Top 0.2: 44.23,5.02 44.25,5 P1.29 44.25,9.43 v42.87,10.81 42.65,10.81 42.25,11.21 | U3.19 19.97,18.3 20.62,17.65 v20.62,15.05
  Top 0.203: U1.41 42.25,11.21
  Bottom 0.2: v20.62,15.05 20.62,14.35 23.62,11.34 27.38,11.34 29.54,13.51 37.44,13.51 38.83,12.12 40.29,12.12 40.84,11.57 42.11,11.57 v42.87,10.81
GND  (via drill 0.35)
  Top 0.203: C9.2 3,22.86 v2.72,22.59 | R10.2 23.85,45.61 22.7,45.61 22.25,45.16 22.25,42.91 21.1,42.91 21.1,42.21 Q1.2
  Top 0.4: B1.- 47.8,32.96
  Top 0.5: 17.98,42.04 18.06,42.11 | 22,36.11 17.98,36.11 | 49,10.11 50,11.11 | 22.5,24.58 23.71,23.37 23.71,22.12 | v11.7,18.41 11.7,14.56 10.36,13.22
  Top 1.5: P1.32 49,10.11
  Bottom 0.203: 18.45,43.51 18.06,43.11 18.06,42.11
  Bottom 0.5: 18.06,42.11 16,42.11
  other vias: 20.75,18.96 8,53.86 7.8,52.51 8,55.11 11,42.11 8.6,40.21 6.6,38.71 4.6,36.71 8.6,36.71 10.1,38.71 18.06,35.86 20.06,35.86 20.06,34.21 20.06,32.46 21.85,19.91 11.2,21.51 11.7,17.31 11.7,16.11 11.7,15.01 7.1,13.81 9.2,12.01 10.2,12.01 28.5,19.91 30.5,19.91 30.5,17.91 30.5,15.91 32.5,15.91 32.5,17.91 34.5,17.91 31.5,9.91 32.5,9.91 50.15,32.41 50.15,28.41 50.15,24.41 50.15,20.41 50.15,16.81 50.15,13.41 49,9.11 49.2,13.41 49.2,16.81 47.2,20.41 37.9,17.81 37.9,19.11 37.9,20.51 34.5,27.01 34.5,30.01 11.05,49.81 11.6,35.71 5.6,35.71 21.3,18.06 21.8,18.96 22.85,19.86 44,14.51 43,22.31 43,20.31 43,15.66 24.65,26.06 30,8.11 34.2,9.91 37.9,15.26 47.2,26.41 47.2,28.41 32.75,27.01 32.75,30.01 28.35,34.26 26.3,31.86 26.3,32.86 28.35,35.86 32.75,33.01 34.5,34.01 38.35,33.71 49.15,32.41 49.15,34.31 50.15,34.31 50.15,26.41 18.46,40.71 38.8,13.21 27.95,31.91 30.3,32.91 11,45.61 13.1,45.61 14.05,45.61 16.81,34.66 18.51,31.16 22.26,34.71 18.31,45.61 17.76,49.61 15.36,49.66 13.01,48.31 13.9,55.81 4.15,55.81 6.15,55.81 19.46,42.71 25.3,32.86 25.3,31.86 27.9,27.01 30.4,26.31 16.76,39.06 14.4,54.56 16.7,53.61 18.95,53.61 21.2,48.86 20,45.06 20.7,40.81 21.4,39.71 19.6,39.71 18.46,42.21 11.56,48.31 12.31,50.81 18.76,47.01 17.76,51.66 14.66,51.71 11.15,55.81 10,55.11 10,53.86 10.35,52.71 23.9,26.81 28.7,31.16 30.3,31.91 28.55,26.36 43.44,17.13 44,21.21 37.9,16.56
  pour Bottom (rank 6): -3,63.11 60,63.11 60,-0.89 -4,-0.89 -4,62.11
  pour Top (rank 6): 0,62.11 59,62.11 59,-1.89 58,-2.89 -3,-2.89 -3,59.11
  pour Top: 38.85,32.61 38.85,34.21 37.2,34.21 37.2,32.61
  pour Top (rank 2): 27.6,44.26 arc90 37.65,34.21 37.65,33.61 28,33.61 27.5,34.11 27.5,44.26
N$1  (via drill 0.35)
  Top 0.203: v11.23,30.77 11.63,31.17 U2.7 | SJ2.2 25.54,29.11 v25.18,29.47
  Bottom 0.2: 21,29.79 24.86,29.79 v25.18,29.47
  Bottom 0.203: v11.23,30.77 v11.24,30.77 14.35,30.77 15.33,29.79 21,29.79 21.42,29.79
N$2  (via drill 0.35)
  Top 0.2: SJ1.2 29.75,29.56 28.76,29.56 v28.51,29.81
  Top 0.203: v9.4,30.91 10.37,31.88 U2.6
  Bottom 0.2: v28.51,29.81 28.17,30.14 21.57,30.14
  Bottom 0.203: 21.57,30.14 15.47,30.14 14.19,31.43 9.91,31.43 v9.4,30.91
N$3  (via drill 0.35)
  Top 0.203: 27.15,53.26 27.15,52.06 27.1,52.01 | 31.55,49.11 32.5,49.11
  Top 0.4: 27.18,51.2 B1.+ 27.18,51.76 | 27.1,52.01 27.18,51.76 | R1.2 v25,52.76 26.18,52.76 27.18,51.76
  Bottom 0.203: TP3.TP 25.65,52.76 v25,52.76
  pour Top (rank 4): 32.5,54.61 42,54.61 47.5,49.11 47.5,40.11 41.65,34.26 33.35,34.26 27.5,40.11 27.5,49.61
  pour Top: 28.25,51.71 32.05,51.71 32.05,48.21 28.3,44.46 28,44.46 28,51.46
N$4  (via drill 0.35)
  Top 0.2: U4.5 3.1,47.8 2.7,47.41 v2.7,45.91
  Top 0.203: v15.55,45.61 15.55,45.7 14.94,46.31 SJ3.1
  Bottom 0.2: v2.7,45.91 3.1,46.31 14.9,46.31 15.55,45.66 v15.55,45.61
N$6
  Top 0.2: U5.7 20.75,44.46 Q1.1
N$7  (via drill 0.35)
  Top 0.2: R9.2 18.71,51.9 20.94,51.9 v21.09,52.05 | R10.1 23.65,47.71 v23,48.36 23,48.21 22.3,47.51 21.4,47.51 21.25,47.36 U5.8
  Bottom 0.2: v21.09,52.05 21.09,51.45 22.7,49.84 22.7,48.66 v23,48.36
RA14  (via drill 0.35)
  Top 0.2: v42.56,33.72 42.56,33.32 42.25,33.01 U1.8
  Top 0.203: U2.18 11.63,43.41 11.73,43.31 11.73,40.84 v11.27,40.38
  Bottom 0.2: v42.56,33.72 42.48,33.8 42.48,35.52 40.72,37.29 14.77,37.29 11.69,40.38 v11.27,40.38
RA15  (via drill 0.35)
  Top 0.2: v43.15,34.5 43.21,34.44 43.21,33.45 42.94,33.17 42.75,32.99 U1.7
  Top 0.203: U2.17 12.9,40.09 v13.47,39.53
  Bottom 0.2: v13.47,39.53 13.47,39.51 15.33,37.64 40.87,37.64 43.15,35.36 v43.15,34.5
  Bottom 0.203: v13.47,39.53 13.5,39.53
RA16  (via drill 0.35)
  Top 0.2: v43.87,33.87 43.87,33.61 43.25,32.99 U1.6
  Top 0.203: U2.16 14.18,40.69 v14.07,40.58
  Bottom 0.2: v14.07,40.58 14.72,39.92 14.72,39.23 15.96,38 41.01,38 43.82,35.19 43.82,33.92 v43.87,33.87
  Bottom 0.203: v14.07,40.58 14.07,40.55
RA17  (via drill 0.35)
  Top 0.2: v44.52,34.55 44.53,34.54 44.53,33.6 43.75,32.82 U1.5
  Top 0.203: U2.15 15.45,39.53 v15.4,39.49
  Bottom 0.2: v44.52,34.55 44.47,34.59 44.47,35.04 41.16,38.35 16.27,38.35 15.4,39.22 v15.4,39.49
RA18  (via drill 0.35)
  Top 0.2: v45.18,33.67 45.1,33.67 44.25,32.83 U1.4
  Top 0.203: U2.14 16.71,40.13 v16.8,40.05
  Bottom 0.2: v45.18,33.67 45.28,33.77 45.28,34.73 41.31,38.7 18.14,38.7 v16.8,40.05
RA19  (via drill 0.35)
  Top 0.2: v44.59,31.04 44.75,31.2 U1.3 | v31.35,35.9 31.35,34.91 30.65,34.21 29.7,34.21 29.6,34.21
  Top 0.203: SJ1.3 29.6,31.23 29.6,34.21 | 29.7,34.21 R5.2
  Bottom 0.2: v44.59,31.04 42.96,32.67 40.49,32.67 40.1,33.05 40.1,35.6 39.5,36.2 31.65,36.2 v31.35,35.9
RA20  (via drill 0.35)
  Top 0.2: SJ2.3 25.3,30.63 25.3,30.64 24.49,29.83 24.49,27.8 | v42.71,24.54 42.71,23.7 44.75,21.66 U1.46
  Top 0.203: SJ2.3 27.1,31.23 27.1,34.16 R6.2 | v25.67,25.97 25.67,26.62 24.49,27.8
  Bottom 0.203: v25.67,25.97 25.67,25.92 25.95,25.64 36.94,25.64 37.42,26.12 41.92,26.12 42.71,25.34 v42.71,24.54
RAM_/CS  (via drill 0.35)
  Top 0.2: U2.8 12.9,37.92 14.85,39.87 14.85,45.84 13.74,46.95 v13.79,47 13.99,47.2 13.99,48.6 13.48,49.11 v13.48,51.01 | U4.7 5.63,47.22 v5.38,46.97 | U5.5 20.25,50.95 v18.94,50.95 | v13.48,51.01 13.5,51.02 | Q2.2 13.48,52.28 v13.48,51.01
  Bottom 0.2: v5.38,46.97 5.69,46.66 13.45,46.66 v13.79,47 | v18.94,50.95 13.54,50.95 v13.48,51.01
RAM_/CS_G  (via drill 0.35)
  Top 0.2: 16.1,45.08 16.1,27.36 16.52,26.94 16.52,20.91 17.86,19.57 U3.20 20.18,19.57 21.72,21.11 C11.1 | 16.7,47.86 16.7,47.8 SJ3.2 | U5.6 20.25,47.36 v19.9,47.71 | v17.65,47.91 17.6,47.86 16.7,47.86 | R7.1 16.05,52.31 16.05,52.11 16.7,51.46 16.7,47.86 | R7.1 15.25,53.11 | Q2.3 12.5,54.11 12.65,53.96 14.05,53.96 14.95,53.06 15.3,53.06 R7.1
  Top 0.203: SJ3.2 16.46,45.44 16.1,45.08
  Bottom 0.2: v19.9,47.71 17.85,47.71 v17.65,47.91
SND  (via drill 0.35)
  Top 0.2: 47.25,9.81 P1.31 | v45.6,10.76 44.29,10.76 43.75,11.3
  Top 0.203: v47.1,10.76 47.25,10.76 | 47.25,10.76 47.25,9.81 | R8.2 47.25,14.26 47.25,10.76 | U1.44 43.75,11.3
  Bottom 0.2: v47.1,10.76 v45.6,10.76
VBAT  (via drill 0.35)
  Top 0.203: U5.10 22.25,46.91 22.35,47.01 22.9,47.01 v23,47.11
  Top 0.4: R1.1 23.65,54.49 23.49,54.65 23.49,56.37 23.68,56.56 v23.8,56.56
  Top 0.5: v3.05,56.61 3.1,56.56 U4.4
  Bottom 0.4: v23.8,56.56 23.75,56.61 TP2.TP | v3.05,56.61 TP2.TP | v23,47.11 23,47.14 22.24,47.9 22.24,49.62 20.34,51.52 20.34,54.45 TP2.TP
VCC  (via drill 0.35)
  Top 0.203: v47.05,18.86 47.15,18.76 47.15,16.31 R8.1 | 39.25,29.41 40,29.41 | 40,29.41 40.25,29.41 | 40,29.41 40,20.76 | 40,20.76 v39.75,20.51 | 42.95,35.36 41.62,34.03 40,34.03 | 40,34.03 39.97,34.03 39.25,33.31 | 22.5,60.11 28,60.11 31,57.11 31,56.11 | 21.55,53.56 21.75,53.36 U5.2 | R9.1 21.2,54.46 v21.4,54.26 | U1.37 40.25,14.86 40,15.11 40,20.76 | U1.12 40.25,32.95 40.1,33.1 40.1,33.93 40,34.03
  Top 0.4: C1.1 47.25,31.61 47.25,34.11 46,35.36 42.95,35.36 | C7.1 9.7,48.31
  Top 0.5: 2,10.11 1,11.11 1,44.11 | 1,59.11 2,60.11 22.5,60.11
  Top 1.5: P1.1 2,10.11
  Bottom 0.203: v47.05,18.86 41.4,18.86 v39.75,20.51 | TP5.TP 25.75,55.86 v24.45,55.86
  Bottom 0.4: v21.4,54.26 21.4,54.71 22.29,55.6 24.19,55.6 v24.45,55.86
  other vias: 47,34.01 46.35,34.69 47.48,40.46 48.25,39.96
  pour Top (rank 3): 2.7,1.01 2.7,10.86 2.05,11.51 2.05,37.16 5.3,40.41 5.3,45.21 10.3,45.21 10.3,51.81 6.2,51.81 6.2,48.81 2.65,48.81 2.65,57.06 15.45,57.06 18.05,54.46 24.35,54.46 24.35,53.01 27.55,53.01 27.55,54.46 43.65,54.46 46.8,51.31 47.7,51.31 47.7,44.01 51.3,44.01 51.3,61.81 51,62.11 0,62.11 -1,61.11 -1,2.11 0.1,1.01
  pour Top: 39.25,33.56 39.25,17.36 39.6,17.01 39.6,13.41 40.25,13.41 40.25,33.56
  pour Top (rank 3): 27.56,44.07 arc-90 37.6,54.11 arc-90 47.5,44.21 47.5,43.46 48,43.46 48,54.61 arc90 47,55.61 46,55.61 arc-90 44.5,57.11 arc90 43.5,58.11 28,58.11 arc90 27.5,57.61 27.5,42.76
  pour Top (rank 3): 47.55,44.11 arc-90 37.65,34.21 37.65,33.16 47.35,33.16 47.35,37.76 51.55,37.76 51.55,44.11
  pour Top (rank 2): 26.3,59.21 26.3,55.61 26.9,55.01 26.9,54.51 28.25,54.51 31.4,57.66 31.4,59.21
  pour Top: 19.9,54.61 19.9,52.31 21.7,52.31 21.7,50.36 21.8,50.36 21.8,54.61
  pour Bottom: 46,33.66 46,39.38 47.38,40.76 48.58,40.76 48.58,39.84 47.33,38.59 47.33,33.66
VCC_SRAM  (via drill 0.35)
  Top 0.203: 24.14,27.96 C5.1 | 26.5,48.61 27.15,47.96
  Bottom 0.203: TP1.TP 22.5,54.74 v22.54,54.78
  other vias: 16.95,57.41 15.95,57.41 4.35,47.01 3.4,47.01
  pour Top (rank 2): 15.5,54.36 15.5,57.71 17.25,57.71 17.25,56.71 23.1,56.71 23.1,52.86 26.15,52.86 26.15,38.86 24.45,38.86 24.45,27.51 19.25,27.51 19.25,31.11 19.9,31.76 23,31.76 23,47.51 22.1,47.51 22.1,54.36
  pour Top (rank 2): 4.75,46.61 4.75,48.96 3.05,48.96 3.05,46.61
  pour Bottom: 4.75,46.61 1.7,46.61 1.7,57.91 17.25,57.91 17.25,56.71 2.4,56.71 2.4,47.46 4.75,47.46
  pour Top: 24.5,49.81 27.6,49.81 27.6,36.35 24.5,36.35

### Text on the board
tPlace: 64K | SW1 | RAM SIZE | 256K
tNames: U4 | + | CR2032 | MBC1 | _ | CR2025 | EEPROM | SRAM | 29F016 / 29F032 / 29F033 | 62256 / 6264
tStop: GAME BOY MBC1 CARTRIDGE | 1 | 32
bStop: v1.3 | www.mousebitelabs.com | SUPPORT ORIGINAL CREATORS!
200bmp: C:/Users/Nick/Documents/EAGLE9/projects/534-5344571_open-source-hardware-open-source-hardware-logo-png.bmp | C:/Users/Nick/Documents/EAGLE9/projects/534-5344571_open-source-hardware-open-source-hardware-logo-png.bmp